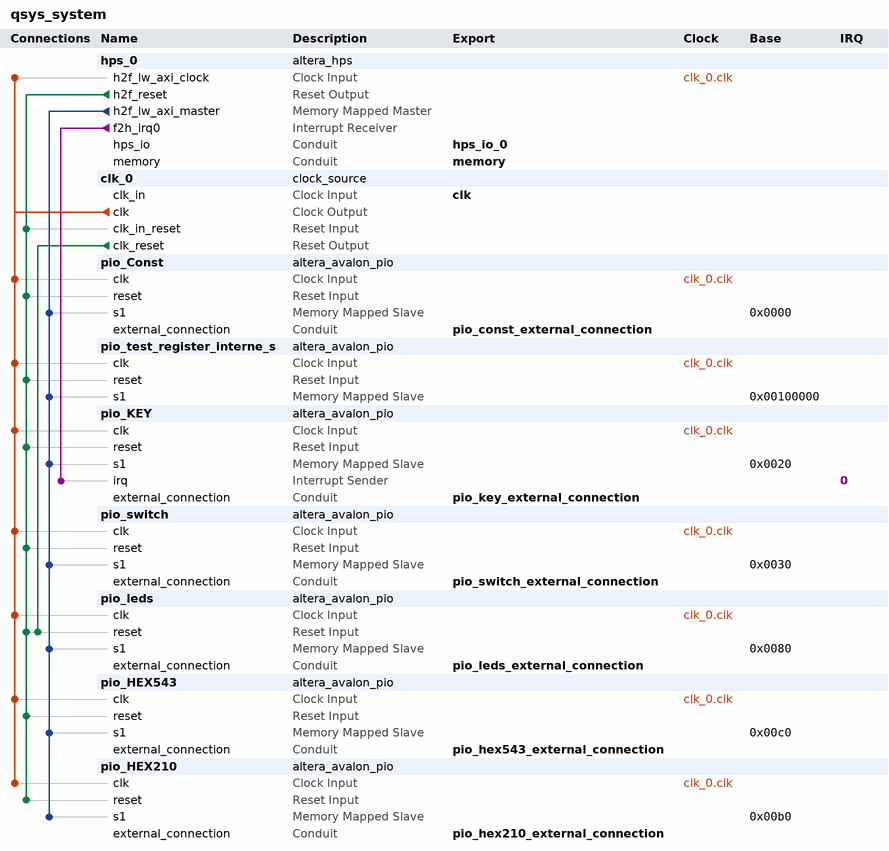
[diagram p0: system contents]
# Platform Designer (Qsys) system qsys_system, Cyclone V 5CSEMA5F31C6
# Parameters at their usual value, and those the tool derives, are not listed.
package require -exact qsys 17.0
create_system qsys_system
set_project_property DEVICE_FAMILY {Cyclone V}
set_project_property DEVICE 5CSEMA5F31C6

add_instance hps_0 altera_hps 17.0
set_instance_parameter_value hps_0 EMAC1_Mode N/A
set_instance_parameter_value hps_0 EMAC1_PinMuxing Unused
set_instance_parameter_value hps_0 F2SCLK_COLDRST_Enable false
set_instance_parameter_value hps_0 F2SCLK_DBGRST_Enable false
set_instance_parameter_value hps_0 F2SCLK_WARMRST_Enable false
set_instance_parameter_value hps_0 F2SINTERRUPT_Enable true
set_instance_parameter_value hps_0 F2S_Width 0
set_instance_parameter_value hps_0 FPGA_PERIPHERAL_OUTPUT_CLOCK_FREQ_EMAC0_GTX_CLK 125
set_instance_parameter_value hps_0 FPGA_PERIPHERAL_OUTPUT_CLOCK_FREQ_EMAC0_MD_CLK 2.5
set_instance_parameter_value hps_0 FPGA_PERIPHERAL_OUTPUT_CLOCK_FREQ_EMAC1_GTX_CLK 125
set_instance_parameter_value hps_0 FPGA_PERIPHERAL_OUTPUT_CLOCK_FREQ_EMAC1_MD_CLK 2.5
set_instance_parameter_value hps_0 HPS_PROTOCOL DDR3
set_instance_parameter_value hps_0 I2C0_Mode N/A
set_instance_parameter_value hps_0 I2C0_PinMuxing Unused
set_instance_parameter_value hps_0 I2C1_Mode N/A
set_instance_parameter_value hps_0 I2C1_PinMuxing Unused
set_instance_parameter_value hps_0 LWH2F_Enable true
set_instance_parameter_value hps_0 MEM_BANKADDR_WIDTH 3
set_instance_parameter_value hps_0 MEM_CLK_FREQ 400.0
set_instance_parameter_value hps_0 MEM_CLK_FREQ_MAX 400.0
set_instance_parameter_value hps_0 MEM_COL_ADDR_WIDTH 10
set_instance_parameter_value hps_0 MEM_DQ_WIDTH 32
set_instance_parameter_value hps_0 MEM_DRV_STR RZQ/7
set_instance_parameter_value hps_0 MEM_ROW_ADDR_WIDTH 15
set_instance_parameter_value hps_0 MEM_RTT_NOM RZQ/4
set_instance_parameter_value hps_0 MEM_RTT_WR RZQ/4
set_instance_parameter_value hps_0 MEM_TCL 11
set_instance_parameter_value hps_0 MEM_TFAW_NS 30.0
set_instance_parameter_value hps_0 MEM_TRAS_NS 35.0
set_instance_parameter_value hps_0 MEM_TRCD_NS 13.75
set_instance_parameter_value hps_0 MEM_TRFC_NS 260.0
set_instance_parameter_value hps_0 MEM_TRP_NS 13.75
set_instance_parameter_value hps_0 MEM_VENDOR JEDEC
set_instance_parameter_value hps_0 MEM_WTCL 8
set_instance_parameter_value hps_0 QSPI_Mode N/A
set_instance_parameter_value hps_0 QSPI_PinMuxing Unused
set_instance_parameter_value hps_0 REF_CLK_FREQ 25.0
set_instance_parameter_value hps_0 S2FCLK_USER2CLK 5
set_instance_parameter_value hps_0 S2F_Width 0
set_instance_parameter_value hps_0 SDIO_Mode N/A
set_instance_parameter_value hps_0 SDIO_PinMuxing Unused
set_instance_parameter_value hps_0 SPIM1_Mode N/A
set_instance_parameter_value hps_0 SPIM1_PinMuxing Unused
set_instance_parameter_value hps_0 STM_Enable false
set_instance_parameter_value hps_0 TIMING_BOARD_AC_SKEW 0.03
set_instance_parameter_value hps_0 TIMING_BOARD_AC_TO_CK_SKEW 0.0
set_instance_parameter_value hps_0 TIMING_BOARD_DQ_TO_DQS_SKEW 0.0
set_instance_parameter_value hps_0 TIMING_BOARD_MAX_CK_DELAY 0.03
set_instance_parameter_value hps_0 TIMING_BOARD_MAX_DQS_DELAY 0.02
set_instance_parameter_value hps_0 TIMING_BOARD_SKEW_BETWEEN_DQS 0.08
set_instance_parameter_value hps_0 TIMING_BOARD_SKEW_CKDQS_DIMM_MAX 0.16
set_instance_parameter_value hps_0 TIMING_BOARD_SKEW_CKDQS_DIMM_MIN 0.09
set_instance_parameter_value hps_0 TIMING_BOARD_SKEW_WITHIN_DQS 0.01
set_instance_parameter_value hps_0 TIMING_TDH 65
set_instance_parameter_value hps_0 TIMING_TDQSCK 255
set_instance_parameter_value hps_0 TIMING_TDQSQ 125
set_instance_parameter_value hps_0 TIMING_TDS 30
set_instance_parameter_value hps_0 TIMING_TIH 140
set_instance_parameter_value hps_0 TIMING_TIS 180
set_instance_parameter_value hps_0 TIMING_TQSH 0.4
set_instance_parameter_value hps_0 UART0_Mode N/A
set_instance_parameter_value hps_0 UART0_PinMuxing Unused
set_instance_parameter_value hps_0 USB1_Mode N/A
set_instance_parameter_value hps_0 USB1_PinMuxing Unused
set_instance_parameter_value hps_0 desired_cfg_clk_mhz 100.0
set_instance_parameter_value hps_0 desired_qspi_clk_mhz 400.0

add_instance clk_0 clock_source 17.0
set_instance_parameter_value clk_0 clockFrequency 50000000

add_instance pio_Const altera_avalon_pio 17.0
set_instance_parameter_value pio_Const direction Input
set_instance_parameter_value pio_Const resetValue 3405648436
set_instance_parameter_value pio_Const width 32

add_instance pio_test_register_interne_s altera_avalon_pio 17.0
set_instance_parameter_value pio_test_register_interne_s direction InOut
set_instance_parameter_value pio_test_register_interne_s width 32

add_instance pio_KEY altera_avalon_pio 17.0
set_instance_parameter_value pio_KEY captureEdge true
set_instance_parameter_value pio_KEY direction Input
set_instance_parameter_value pio_KEY edgeType FALLING
set_instance_parameter_value pio_KEY generateIRQ true
set_instance_parameter_value pio_KEY irqType EDGE
set_instance_parameter_value pio_KEY width 4

add_instance pio_switch altera_avalon_pio 17.0
set_instance_parameter_value pio_switch direction Input
set_instance_parameter_value pio_switch width 10

add_instance pio_leds altera_avalon_pio 17.0
set_instance_parameter_value pio_leds direction Output
set_instance_parameter_value pio_leds width 10

add_instance pio_HEX543 altera_avalon_pio 17.0
set_instance_parameter_value pio_HEX543 direction Output
set_instance_parameter_value pio_HEX543 width 32

add_instance pio_HEX210 altera_avalon_pio 17.0
set_instance_parameter_value pio_HEX210 direction Output
set_instance_parameter_value pio_HEX210 width 32

# connections
add_connection clk_0.clk hps_0.h2f_lw_axi_clock clock
add_connection clk_0.clk pio_Const.clk clock
add_connection clk_0.clk pio_HEX210.clk clock
add_connection clk_0.clk pio_HEX543.clk clock
add_connection clk_0.clk pio_KEY.clk clock
add_connection clk_0.clk pio_leds.clk clock
add_connection clk_0.clk pio_switch.clk clock
add_connection clk_0.clk pio_test_register_interne_s.clk clock
add_connection clk_0.clk_reset pio_leds.reset reset
add_connection hps_0.h2f_reset clk_0.clk_in_reset reset
add_connection hps_0.h2f_reset pio_Const.reset reset
add_connection hps_0.h2f_reset pio_HEX210.reset reset
add_connection hps_0.h2f_reset pio_HEX543.reset reset
add_connection hps_0.h2f_reset pio_KEY.reset reset
add_connection hps_0.h2f_reset pio_leds.reset reset
add_connection hps_0.h2f_reset pio_switch.reset reset
add_connection hps_0.h2f_reset pio_test_register_interne_s.reset reset
add_connection hps_0.h2f_lw_axi_master pio_Const.s1 avalon
set_connection_parameter_value hps_0.h2f_lw_axi_master/pio_Const.s1 baseAddress 0x0000
add_connection hps_0.h2f_lw_axi_master pio_HEX210.s1 avalon
set_connection_parameter_value hps_0.h2f_lw_axi_master/pio_HEX210.s1 baseAddress 0x00b0
add_connection hps_0.h2f_lw_axi_master pio_HEX543.s1 avalon
set_connection_parameter_value hps_0.h2f_lw_axi_master/pio_HEX543.s1 baseAddress 0x00c0
add_connection hps_0.h2f_lw_axi_master pio_KEY.s1 avalon
set_connection_parameter_value hps_0.h2f_lw_axi_master/pio_KEY.s1 baseAddress 0x0020
add_connection hps_0.h2f_lw_axi_master pio_leds.s1 avalon
set_connection_parameter_value hps_0.h2f_lw_axi_master/pio_leds.s1 baseAddress 0x0080
add_connection hps_0.h2f_lw_axi_master pio_switch.s1 avalon
set_connection_parameter_value hps_0.h2f_lw_axi_master/pio_switch.s1 baseAddress 0x0030
add_connection hps_0.h2f_lw_axi_master pio_test_register_interne_s.s1 avalon
set_connection_parameter_value hps_0.h2f_lw_axi_master/pio_test_register_interne_s.s1 baseAddress 0x00100000
add_connection hps_0.f2h_irq0 pio_KEY.irq interrupt
set_connection_parameter_value hps_0.f2h_irq0/pio_KEY.irq irqNumber 0

# exported interfaces
add_interface clk clock sink
set_interface_property clk EXPORT_OF clk_0.clk_in
add_interface hps_io_0 conduit end
set_interface_property hps_io_0 EXPORT_OF hps_0.hps_io
add_interface memory conduit end
set_interface_property memory EXPORT_OF hps_0.memory
add_interface pio_const_external_connection conduit end
set_interface_property pio_const_external_connection EXPORT_OF pio_Const.external_connection
add_interface pio_hex210_external_connection conduit end
set_interface_property pio_hex210_external_connection EXPORT_OF pio_HEX210.external_connection
add_interface pio_hex543_external_connection conduit end
set_interface_property pio_hex543_external_connection EXPORT_OF pio_HEX543.external_connection
add_interface pio_key_external_connection conduit end
set_interface_property pio_key_external_connection EXPORT_OF pio_KEY.external_connection
add_interface pio_leds_external_connection conduit end
set_interface_property pio_leds_external_connection EXPORT_OF pio_leds.external_connection
add_interface pio_switch_external_connection conduit end
set_interface_property pio_switch_external_connection EXPORT_OF pio_switch.external_connection

set_interconnect_requirement {$system} qsys_mm.clockCrossingAdapter HANDSHAKE
set_interconnect_requirement {$system} qsys_mm.enableEccProtection FALSE
set_interconnect_requirement {$system} qsys_mm.insertDefaultSlave FALSE
set_interconnect_requirement {$system} qsys_mm.maxAdditionalLatency 1

save_system qsys_system.qsys
